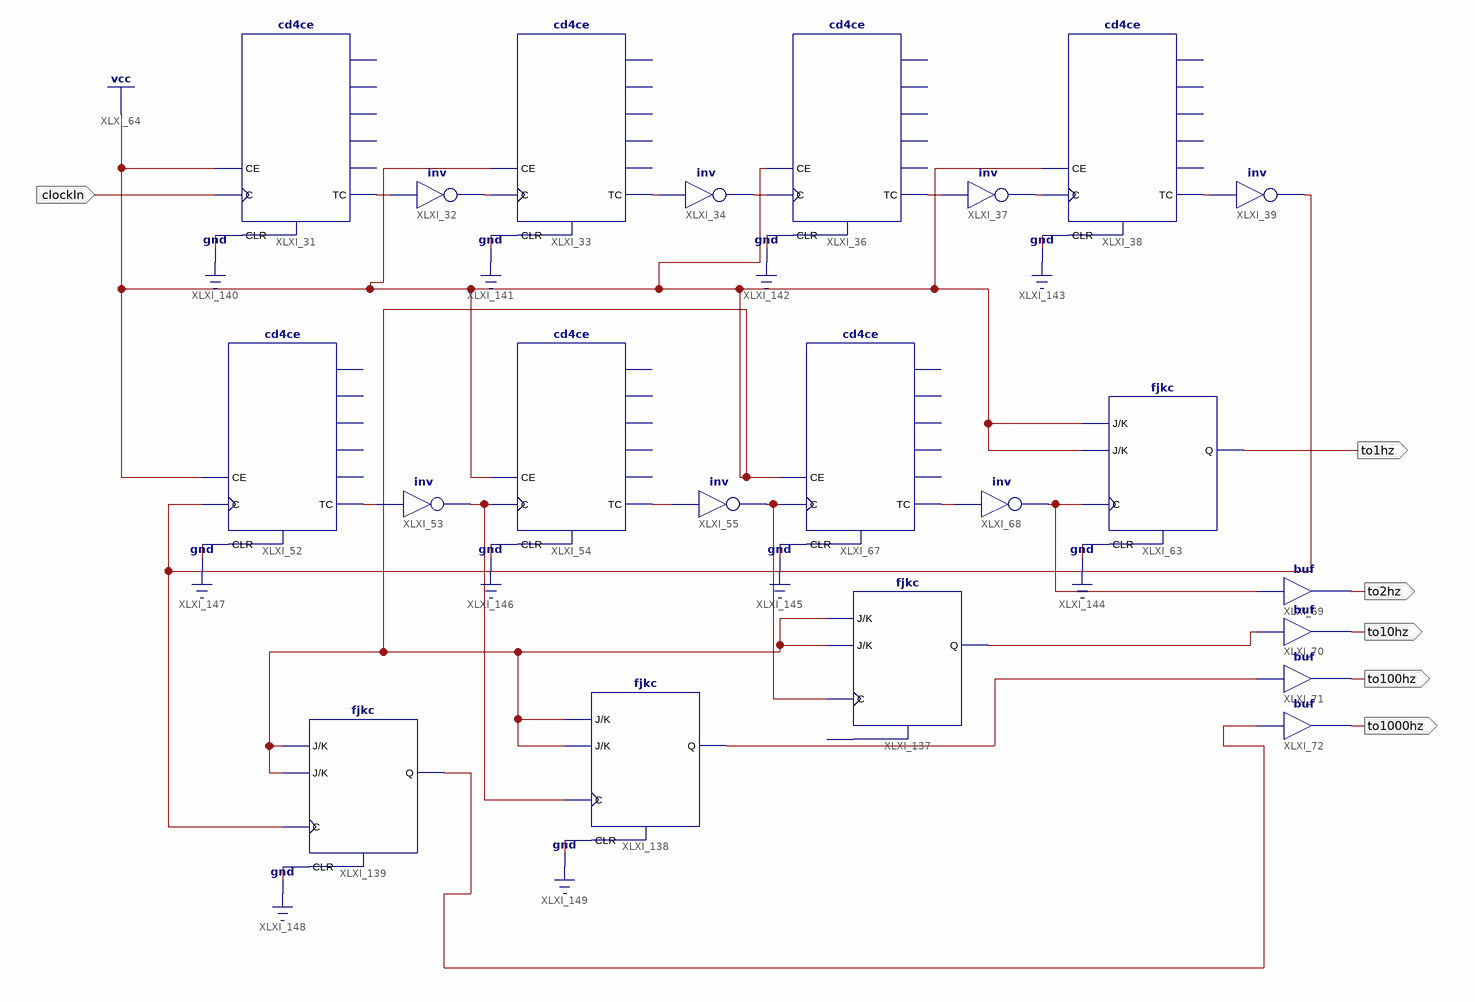
[diagram p0: schematic sheet 1]
// Xilinx ISE schematic to_1_2_10_100_1000Hz.sch (spartan6) as structural Verilog: 22 symbols, 6 ports
module to_1_2_10_100_1000Hz (
  input  clockIn,
  output to1hz,
  output to2hz,
  output to10hz,
  output to100hz,
  output to1000hz
);

  wire XLXN_43, XLXN_44, XLXN_49, XLXN_50, XLXN_52, XLXN_53, XLXN_54, XLXN_73, XLXN_88, XLXN_101, XLXN_115,
       XLXN_215, XLXN_217, XLXN_233, XLXN_238, XLXN_243, XLXN_254;

  cd4ce XLXI_31 (.C(clockIn), .CE(1'b1), .CLR(1'b0), .TC(XLXN_43));  // open: CEO, Q0, Q1, Q2, Q3
  not XLXI_32 (XLXN_49, XLXN_43);
  cd4ce XLXI_33 (.C(XLXN_49), .CE(1'b1), .CLR(1'b0), .TC(XLXN_44));  // open: CEO, Q0, Q1, Q2, Q3
  not XLXI_34 (XLXN_50, XLXN_44);
  cd4ce XLXI_36 (.C(XLXN_50), .CE(1'b1), .CLR(1'b0), .TC(XLXN_52));  // open: CEO, Q0, Q1, Q2, Q3
  not XLXI_37 (XLXN_54, XLXN_52);
  cd4ce XLXI_38 (.C(XLXN_54), .CE(1'b1), .CLR(1'b0), .TC(XLXN_53));  // open: CEO, Q0, Q1, Q2, Q3
  not XLXI_39 (XLXN_101, XLXN_53);
  cd4ce XLXI_52 (.C(XLXN_101), .CE(1'b1), .CLR(1'b0), .TC(XLXN_88));  // open: CEO, Q0, Q1, Q2, Q3
  not XLXI_53 (XLXN_238, XLXN_88);
  cd4ce XLXI_54 (.C(XLXN_238), .CE(1'b1), .CLR(1'b0), .TC(XLXN_73));  // open: CEO, Q0, Q1, Q2, Q3
  not XLXI_55 (XLXN_215, XLXN_73);
  cd4ce XLXI_67 (.C(XLXN_215), .CE(1'b1), .CLR(1'b0), .TC(XLXN_115));  // open: CEO, Q0, Q1, Q2, Q3
  fjkc XLXI_63 (.C(XLXN_243), .CLR(1'b0), .J(1'b1), .K(1'b1), .Q(to1hz));
  not XLXI_68 (XLXN_243, XLXN_115);
  buf XLXI_69 (to2hz, XLXN_243);
  buf XLXI_70 (to10hz, XLXN_217);
  buf XLXI_71 (to100hz, XLXN_233);
  buf XLXI_72 (to1000hz, XLXN_254);
  fjkc XLXI_137 (.C(XLXN_215), .J(1'b1), .K(1'b1), .Q(XLXN_217));  // open: CLR
  fjkc XLXI_138 (.C(XLXN_238), .CLR(1'b0), .J(1'b1), .K(1'b1), .Q(XLXN_233));
  fjkc XLXI_139 (.C(XLXN_101), .CLR(1'b0), .J(1'b1), .K(1'b1), .Q(XLXN_254));
endmodule
